# Altium schematic sheet TPS_BUCK_BOOST.SchDoc
size A; SheetNumber: 4; SheetTotal: 7
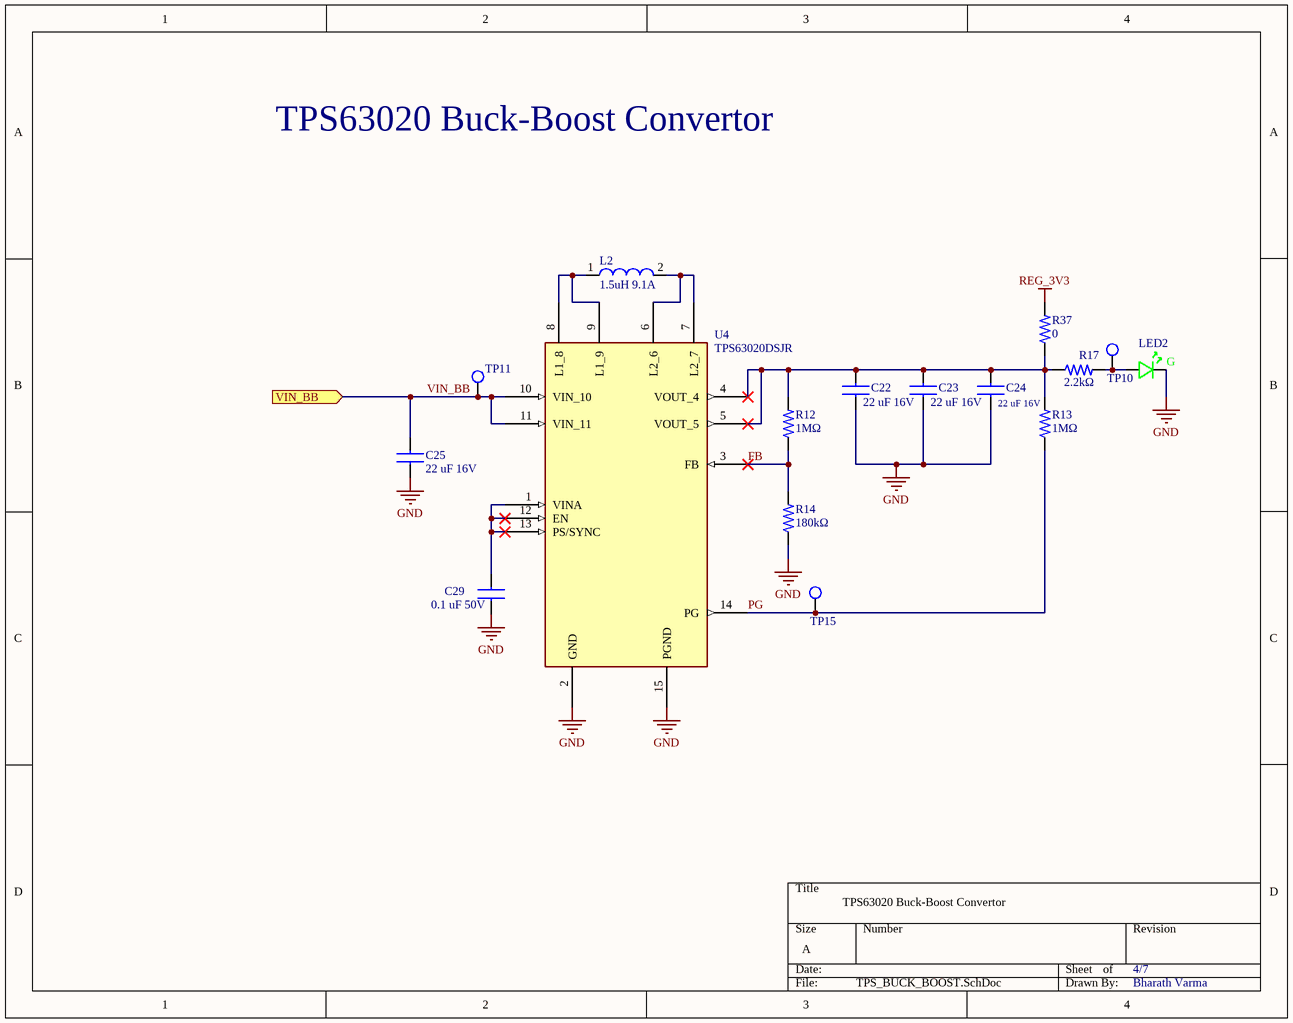
[diagram p0: TPS_BUCK_BOOST.SchDoc]

## Parts
C22  22 uF 16V  [CAPC1608X90N]
C23  22 uF 16V  [CAPC1608X90N]
C24  22 uF 16V  [CAPC1608X90N]
C25  22 uF 16V  [CAPC1608X90N]
C29  0.1 uF 50V  [CAPC1608X90N]
L2  1.5uH 9.1A  [IND_PCC-M0630M-LP_PAN]
LED2  GRN 0603  [LED_0603_GRN_WL-SMCW]  (value not drawn)
R12  1MΩ  [RESC1508X55N]
R13  1MΩ  [RESC1508X55N]
R14  180kΩ  [RESC1508X55N]
R17  2.2kΩ  [RESC1508X55N]
R37  0  [RES_0603_1608X06]
TP10  Test Point  [Test Point]  (value not drawn)  (net tie, no BOM)
TP11  Test Point  [Test Point]  (value not drawn)  (net tie, no BOM)
TP15  Test Point  [Test Point]  (value not drawn)  (net tie, no BOM)
U4  TPS63020DSJR  [IC_TPS63020DSJR]

## Ports
VIN_BB (in, see BQ25798_PMIC[4B])

## Nets
GND: C22.2 C23.2 C24.2 C25.2 C29.2 LED2.C R14.1 U4.2(GND) U4.15(PGND)
REG_3V3: R37.2
FB: R12.1 R14.2 U4.3(FB)
PG: R13.1 TP15.1 U4.14(PG)
VIN_BB: C25.1 TP11.1 U4.10(VIN_10) U4.11(VIN_11) ; port VIN_BB
NetC22_1: C22.1 C23.1 C24.1 R12.2 R13.2 R17.1 R37.1 U4.4(VOUT_4) U4.5(VOUT_5)
NetC29_1: C29.1 U4.1(VINA) U4.12(EN) U4.13(PS/SYNC)
NetL2_1: L2.1 U4.8(L1_8) U4.9(L1_9)
NetL2_2: L2.2 U4.6(L2_6) U4.7(L2_7)
NetLED2_A: LED2.A R17.2 TP10.1

## Notes on the sheet
- TPS63020 Buck-Boost Convertor
- 4/7
- Bharath Varma
- (in symbol 150060GS75000) G

## Library data of the parts
C22-C25 = CL10A226MO7JZNC: 22 µF ±20% 16V Ceramic Capacitor X5R 0603 (1608 Metric); MF: Samsung Electro-Mechanics; SnapEDA_Link: https://www.snapeda.com/parts/CL10A226MO7JZNC/Samsung/view-part/?ref=snap; Package: 1608-2 SAMSUNG; Value: *; MP: CL10A226MO7JZNC; Check_prices: https://www.snapeda.com/parts/CL10A226MO7JZNC/Samsung/view-part/?ref=eda
C29 = GCM31C5C1H104FA16L: 0.10uF Tol.1%. Rated voltage 50Vdc 125C SMD capacitor C0G(EIA) with capacitance; MF: Murata; Check_prices: https://www.snapeda.com/parts/GCM31C5C1H104FA16L/Murata/view-part/?ref=eda; Value: *; MP: GCM31C5C1H104FA16L; Purchase-URL: https://pricing.snapeda.com/search/part/GCM31C5C1H104FA16L/?ref=eda; SnapEDA_Link: https://www.snapeda.com/parts/GCM31C5C1H104FA16L/Murata/view-part/?ref=snap; Package: 3216 Murata; Digi-Key_Part_Number: 490-GCM31C5C1H104FA16LTR-ND
L2 = ETQ-P3M1R5KVN: Description; Manufacturer_Name: Panasonic; Copyright: Copyright (C) 2025 Ultra Librarian. All rights reserved.; Manufacturer_Part_Number: ETQ-P3M1R5KVN
LED2 = 150060GS75000: LED, 0603, GREEN, 430MCD, 520NM; Manufacturer: Wurth Electronics; Dynamic Catalog: 0603 Rectangle with Flat Top Chip LEDs; 3D Model: SMCW_0603.igs / SMCW_0603.stp / SMCW_0603.wrl; Wavelength - Peak: 515nm; Voltage - Forward (Vf) (Typ): 3.2V; Current - Test: 20mA; Viewing Angle: 140°; Lens Type: Clear; Lens Style/Size: Rectangle with Flat Top, 1.1mm x 0.7mm; Other Names: 732-4971-2; Supplier 1: Digi-Key; Manufacturer Part Number: 150060GS75000; Stock 1: 34964; Pricing 1: 1=0.14, 50=0.129, 100=0.11, 500=0.095 (USD); Standard Package: 4,000; Category: Optoelectronics; Family: LED Indication - Discrete; Series: WL-SMCW; Packaging: Tape & Reel (TR); Color: Green; Wavelength - Dominant: 520nm; Millicandela Rating: 430mcd; Package / Case: 0603 (1608 Metric); Size / Dimension: 1.60mm L x 0.80mm W; Height: 0.70mm; Mounting Type: Surface Mount; Online Catalog: 0603 Rectangle with Flat Top Chip LEDs; ComponentLink1URL: https://katalog.we-online.de/led/datasheet/150060GS75000.pdf?src-supplier=Digi-Key; ComponentLink1Description: https://katalog.we-online.de/led/datasheet/150060GS75000.pdf?src-supplier=Digi-Key; ComponentLink2URL: http://www.produktinfo.conrad.com/datenblaetter/750000-774999/759427-da-01-en-CHIPLED_0603_W_KL_GRUEN_150060GS75000.pdf?src-supplier=Conrad; ComponentLink2Description: http://www.produktinfo.conrad.com/datenblaetter/750000-774999/759427-da-01-en-CHIPLED_0603_W_KL_GRUEN_150060GS75000.pdf?src-supplier=Conrad; Supplier Part Number 1: 732-4971-1-ND
R12 R13 = RMCF0603JT1M00: 1 MOhms ±5% 0.1W, 1/10W Chip Resistor 0603 (1608 Metric) Automotive AEC-Q200 Thick Film; Package: None; Price: None; Value: *; MP: RMCF0603JT1M00; Availability: Unavailable
R14 = RMCF0603FT180K: 180 kOhms ±1% 0.1W, 1/10W Chip Resistor 0603 (1608 Metric) Automotive AEC-Q200 Thick Film; MF: Stackpole Electronics Inc; SnapEDA_Link: https://www.snapeda.com/parts/RMCF0603FT180K/Stackpole+Electronics/view-part/?ref=snap; Package: 1508 Stackpole; Value: *; MP: RMCF0603FT180K; Check_prices: https://www.snapeda.com/parts/RMCF0603FT180K/Stackpole+Electronics/view-part/?ref=eda
R17 = RN73H1JTTD2201F50: RES 2.2K OHM 1% 1/10W 0603; Package: None; Price: None; Value: *; MP: RN73H1JTTD2201F50; Availability: Unavailable
R37 = MCT06030Z0000ZP500: 0 Ohms Jumper 0.125W, 1/8W Chip Resistor 0603 (1608 Metric) Anti-Sulfur Thin Film; MF: Vishay; SnapEDA_Link: https://www.snapeda.com/parts/MCT06030Z0000ZP500/Vishay+Beyschlag/view-part/?ref=snap; Package: 1508 Vishay; Value: *; MP: MCT06030Z0000ZP500; Check_prices: https://www.snapeda.com/parts/MCT06030Z0000ZP500/Vishay+Beyschlag/view-part/?ref=eda
U4 = TPS63020DSJR: High Efficiency Single Inductor Buck-Boost Converter with 4A Switch; MF: Texas Instruments; SnapEDA_Link: https://www.snapeda.com/parts/TPS63020DSJR/Texas+Instruments/view-part/?ref=snap; Package: VSON-14 Texas Instruments; Value: *; MP: TPS63020DSJR; Check_prices: https://www.snapeda.com/parts/TPS63020DSJR/Texas+Instruments/view-part/?ref=eda